# Altium schematic sheet 4-USB & SATA.SchDoc: USB & SATA
size B; CompanyName: NGRF; Address1: 2130 Howard Drive W; Address2: North Mankato, MN 56003; Address3: www.nextgenrf.com; Revision: 2; SheetNumber: 4; SheetTotal: 7; ProjName: BytePipe X9002_HDK
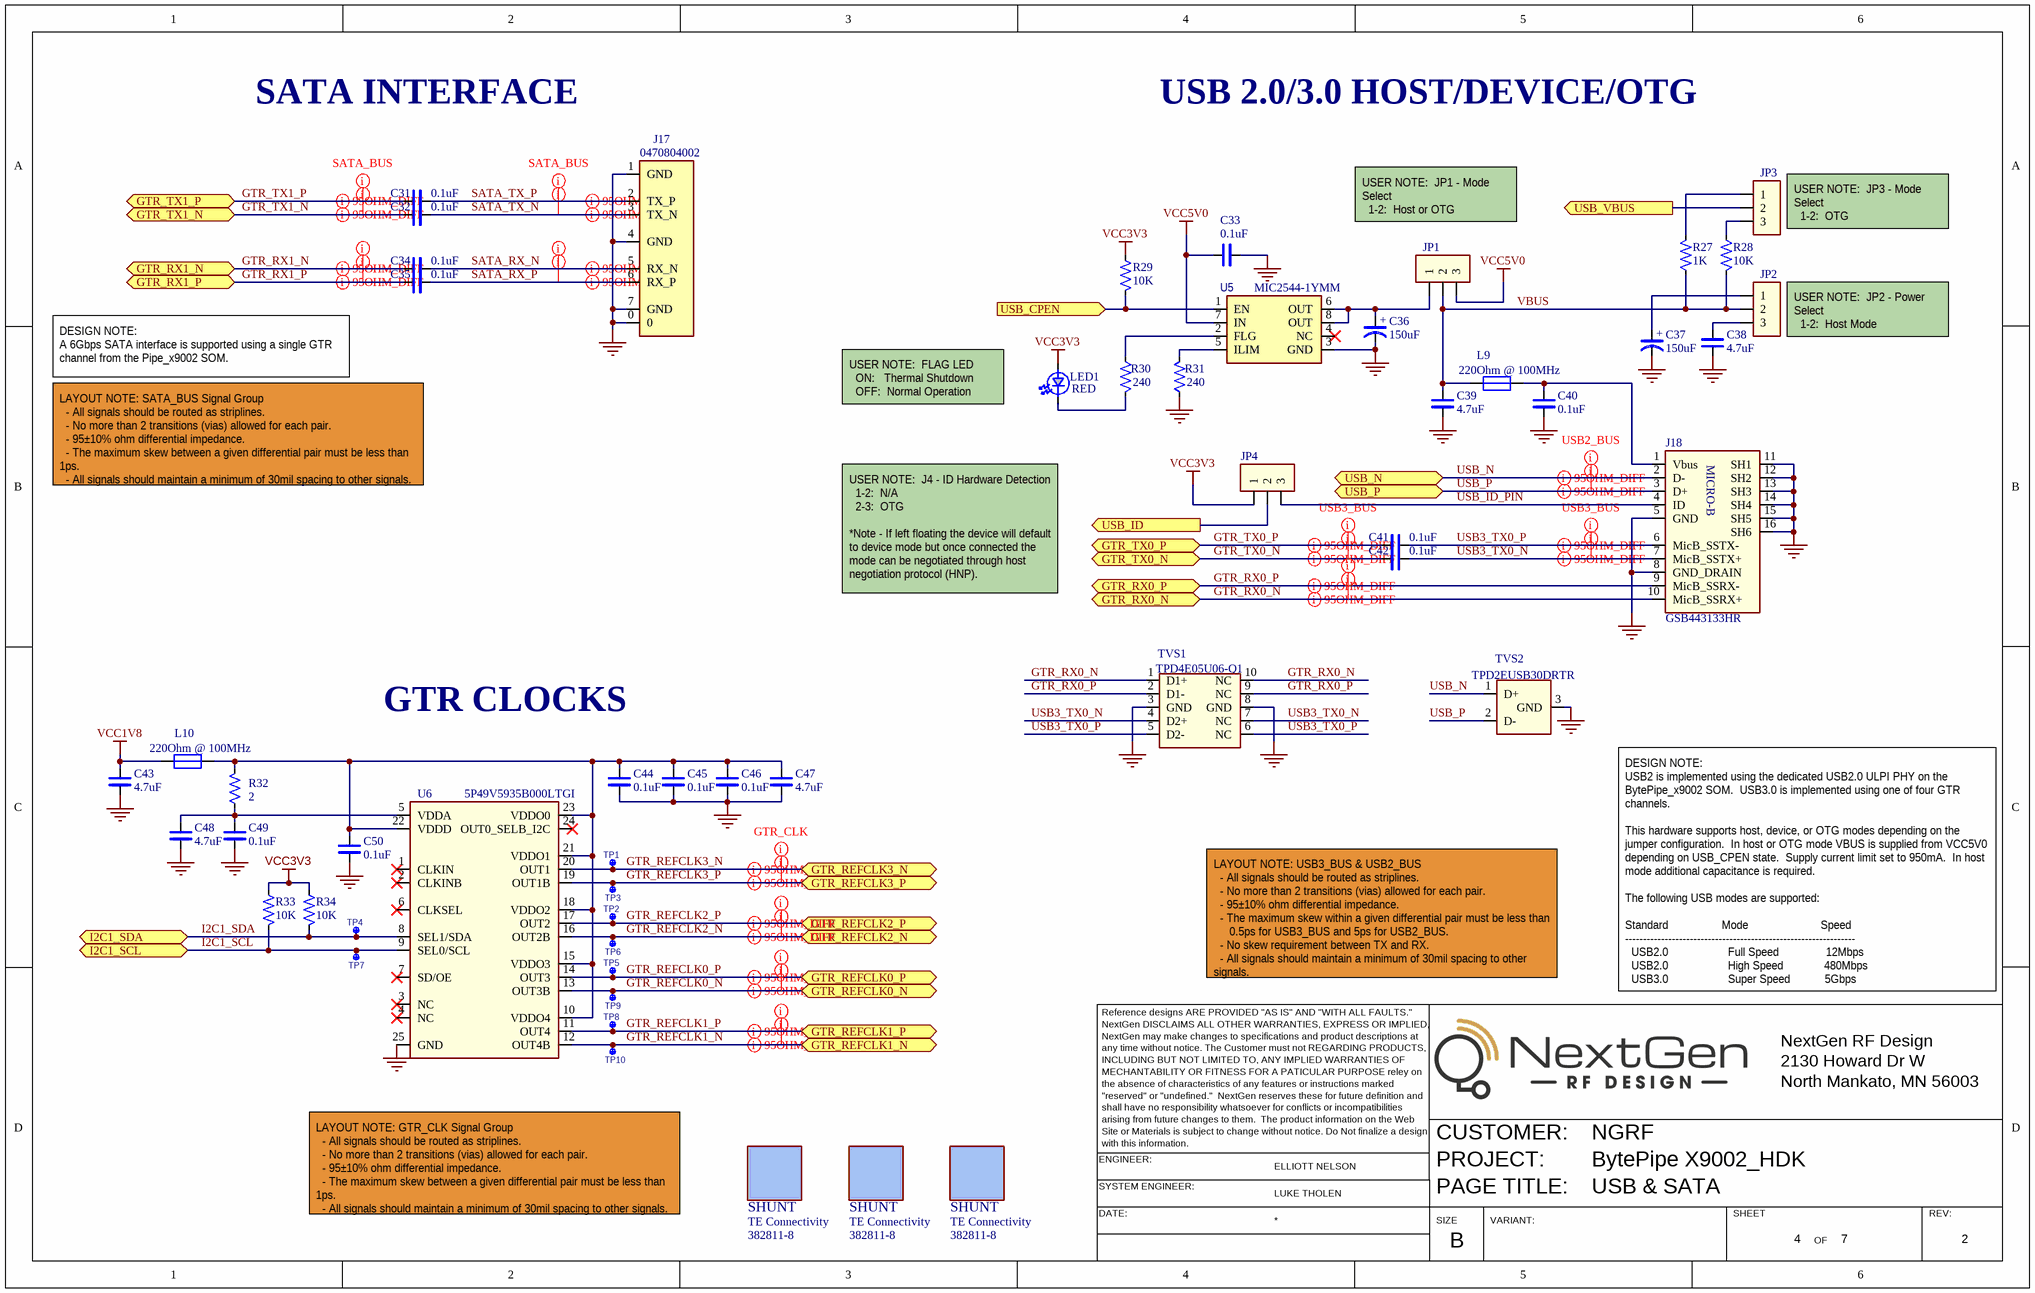
[diagram p0: 4-USB & SATA.SchDoc]

## Parts
C31  value 0.1uF  [SM/0402/CAP]  (hidden comment: CAP_CERAMIC_0402)
C32  value 0.1uF  [SM/0402/CAP]  (hidden comment: CAP_CERAMIC_0402)
C33  value 0.1uF  [SM/0402/CAP]  (hidden comment: CAP_CERAMIC_0402)
C34  value 0.1uF  [SM/0402/CAP]  (hidden comment: CAP_CERAMIC_0402)
C35  value 0.1uF  [SM/0402/CAP]  (hidden comment: CAP_CERAMIC_0402)
C36  value 150uF  [SM/CAP/TANT-D_A]  (hidden comment: TANT-D)
C37  value 150uF  [SM/CAP/TANT-D_A]  (hidden comment: TANT-D)
C38  value 4.7uF  [SM/0402/CAP]  (hidden comment: CAP_CERAMIC_0402)
C39  value 4.7uF  [SM/0402/CAP]  (hidden comment: CAP_CERAMIC_0402)
C40  value 0.1uF  [SM/0402/CAP]  (hidden comment: CAP_CERAMIC_0402)
C41  value 0.1uF  [SM/0402/CAP]  (hidden comment: CAP_CERAMIC_0402)
C42  value 0.1uF  [SM/0402/CAP]  (hidden comment: CAP_CERAMIC_0402)
C43  value 4.7uF  [SM/0402/CAP]  (hidden comment: CAP_CERAMIC_0402)
C44  value 0.1uF  [SM/0402/CAP]  (hidden comment: CAP_CERAMIC_0402)
C45  value 0.1uF  [SM/0402/CAP]  (hidden comment: CAP_CERAMIC_0402)
C46  value 0.1uF  [SM/0402/CAP]  (hidden comment: CAP_CERAMIC_0402)
C47  value 4.7uF  [SM/0402/CAP]  (hidden comment: CAP_CERAMIC_0402)
C48  value 4.7uF  [SM/0402/CAP]  (hidden comment: CAP_CERAMIC_0402)
C49  value 0.1uF  [SM/0402/CAP]  (hidden comment: CAP_CERAMIC_0402)
C50  value 0.1uF  [SM/0402/CAP]  (hidden comment: CAP_CERAMIC_0402)
J17  value 0470804002  [SM/CON/MLX/SATA/0470804002]  (hidden comment: CON_MOLEX_0470804002)
J18  value GSB443133HR  [SM/CON/USB3.1/MICRO B]  (hidden comment: CON_USB_3.1_MICRO-B_RA)
JP1  CON_100SP_1X3P_038H  [CON/100SP/1X3P]  (value not drawn)
JP2  CON_100SP_1X3P_038H  [CON/100SP/1X3P]  (value not drawn)
JP3  CON_100SP_1X3P_038H  [CON/100SP/1X3P]  (value not drawn)
JP4  CON_100SP_1X3P_038H  [CON/100SP/1X3P]  (value not drawn)
L9  value 220Ohm @ 100MHz  [SM/0603]  (hidden comment: FERRITE_0603_A)
L10  value 220Ohm @ 100MHz  [SM/0603]  (hidden comment: FERRITE_0603_A)
LED1  value RED  [SM/LED_0603]  (hidden comment: LED_0603)
R27  value 1K  [SM/0402/RES]  (hidden comment: RES_0402_A)
R28  value 10K  [SM/0402/RES]  (hidden comment: RES_0402_A)
R29  value 10K  [SM/0402/RES]  (hidden comment: RES_0402_A)
R30  value 240  [SM/0402/RES]  (hidden comment: RES_0402_A)
R31  value 240  [SM/0402/RES]  (hidden comment: RES_0402_A)
R32  value 2  [SM/0402/RES]  (hidden comment: RES_0402_A)
R33  value 10K  [SM/0402/RES]  (hidden comment: RES_0402_A)
R34  value 10K  [SM/0402/RES]  (hidden comment: RES_0402_A)
S1  SHUNT  OEM NAME: TE Connectivity  OEM#: 382811-8
S2  SHUNT  OEM NAME: TE Connectivity  OEM#: 382811-8
S3  SHUNT  OEM NAME: TE Connectivity  OEM#: 382811-8
TP1  TESTPOINT_030  [SM/TESTPOINT/30MIL]  (value not drawn)  (no BOM)
TP2  TESTPOINT_030  [SM/TESTPOINT/30MIL]  (value not drawn)  (no BOM)
TP3  TESTPOINT_030  [SM/TESTPOINT/30MIL]  (value not drawn)  (no BOM)
TP4  TESTPOINT_030  [SM/TESTPOINT/30MIL]  (value not drawn)  (no BOM)
TP5  TESTPOINT_030  [SM/TESTPOINT/30MIL]  (value not drawn)  (no BOM)
TP6  TESTPOINT_030  [SM/TESTPOINT/30MIL]  (value not drawn)  (no BOM)
TP7  TESTPOINT_030  [SM/TESTPOINT/30MIL]  (value not drawn)  (no BOM)
TP8  TESTPOINT_030  [SM/TESTPOINT/30MIL]  (value not drawn)  (no BOM)
TP9  TESTPOINT_030  [SM/TESTPOINT/30MIL]  (value not drawn)  (no BOM)
TP10  TESTPOINT_030  [SM/TESTPOINT/30MIL]  (value not drawn)  (no BOM)
TVS1  value TPD4E05U06-Q1  [SM/DFN10/2.5X1MM_A]  (hidden comment: TVS_TPD4E05U06_2.5mmX1mm)
TVS2  value TPD2EUSB30DRTR  [SM/SOT3_A]  (hidden comment: TVS_TPD2EUSB30DRTR_SOT3)
U5  value MIC2544-1YMM  [SM/MSOP8_A]  (hidden comment: IC_MIC2544-1YMM_MSOP-8)
U6  value 5P49V5935B000LTGI  [SM/LGA24/4X4/0.5LS_A]  (hidden comment: IC_5P49V5935_LGA-24)

## Ports
GTR_REFCLK0_N (bidir), GTR_REFCLK0_P (bidir), GTR_REFCLK1_N (bidir), GTR_REFCLK1_P (bidir), GTR_REFCLK2_N (bidir), GTR_REFCLK2_P (bidir), GTR_REFCLK3_N (bidir), GTR_REFCLK3_P (bidir), GTR_RX0_N (bidir), GTR_RX0_P (bidir), GTR_RX1_N (bidir), GTR_RX1_P (bidir), GTR_TX0_N (bidir), GTR_TX0_P (bidir), GTR_TX1_N (bidir), GTR_TX1_P (bidir), I2C1_SCL (bidir), I2C1_SDA (bidir), USB_CPEN (in), USB_ID (out), USB_N (bidir), USB_P (bidir), USB_VBUS (out)

## Nets
GND: C33.2(N2) C36.2(N) C37.2(N) C38.2(N2) C39.2(N2) C40.2(N2) C43.2(N2) C44.2(N2) C45.2(N2) C46.2(N2) C47.2(N2) C48.2(N2) C49.2(N2) C50.2(N2) J17.0 J17.1(GND) J17.4(GND) J17.7(GND) J18.5(GND) J18.8(GND_DRAIN) J18.11(SH1) J18.12(SH2) J18.13(SH3) J18.14(SH4) J18.15(SH5) J18.16(SH6) R31.2 TVS1.3(GND) TVS1.8(GND) TVS2.3(GND) U5.3(GND) U6.25(GND)
VCC1V8: C43.1(N1) L10.1(PIN1)
VCC3V3: JP4.1 LED1.2(A) R29.1 R33.1 R34.1
VCC5V0: C33.1(N1) JP1.3 U5.7(IN)
GTR_REFCLK0_N: TP9.1(N1) U6.13(OUT3B) ; port GTR_REFCLK0_N
GTR_REFCLK0_P: TP5.1(N1) U6.14(OUT3) ; port GTR_REFCLK0_P
GTR_REFCLK1_N: TP10.1(N1) U6.12(OUT4B) ; port GTR_REFCLK1_N
GTR_REFCLK1_P: TP8.1(N1) U6.11(OUT4) ; port GTR_REFCLK1_P
GTR_REFCLK2_N: TP6.1(N1) U6.16(OUT2B) ; port GTR_REFCLK2_N
GTR_REFCLK2_P: TP2.1(N1) U6.17(OUT2) ; port GTR_REFCLK2_P
GTR_REFCLK3_N: TP1.1(N1) U6.20(OUT1) ; port GTR_REFCLK3_N
GTR_REFCLK3_P: TP3.1(N1) U6.19(OUT1B) ; port GTR_REFCLK3_P
GTR_RX0_N: J18.10(MicB_SSRX+) TVS1.1(D1+) TVS1.10(NC) ; port GTR_RX0_N
GTR_RX0_P: J18.9(MicB_SSRX-) TVS1.2(D1-) TVS1.9(NC) ; port GTR_RX0_P
GTR_RX1_N: C34.1(N1) ; port GTR_RX1_N
GTR_RX1_P: C35.1(N1) ; port GTR_RX1_P
GTR_TX0_N: C42.1(N1) ; port GTR_TX0_N
GTR_TX0_P: C41.1(N1) ; port GTR_TX0_P
GTR_TX1_N: C32.1(N1) ; port GTR_TX1_N
GTR_TX1_P: C31.1(N1) ; port GTR_TX1_P
I2C1_SCL: R33.2 TP7.1(N1) U6.9(SEL0/SCL) ; port I2C1_SCL
I2C1_SDA: R34.2 TP4.1(N1) U6.8(SEL1/SDA) ; port I2C1_SDA
SATA_RX_N: C34.2(N2) J17.5(RX_N)
SATA_RX_P: C35.2(N2) J17.6(RX_P)
SATA_TX_N: C32.2(N2) J17.3(TX_N)
SATA_TX_P: C31.2(N2) J17.2(TX_P)
USB3_TX0_N: C42.2(N2) J18.7(MicB_SSTX+) TVS1.4(D2+) TVS1.7(NC)
USB3_TX0_P: C41.2(N2) J18.6(MicB_SSTX-) TVS1.5(D2-) TVS1.6(NC)
USB_CPEN: R29.2 U5.1(EN) ; port USB_CPEN
USB_ID: JP4.2 ; port USB_ID
USB_ID_PIN: J18.4(ID) JP4.3
USB_N: J18.2(D-) TVS2.1(D+) ; port USB_N
USB_P: J18.3(D+) TVS2.2(D-) ; port USB_P
USB_VBUS: JP3.2 ; port USB_VBUS
VBUS: C39.1(N1) JP1.2 JP2.2 L9.1(PIN1) R27.1 R28.2
NetC36_1: C36.1(+) JP1.1 U5.6(OUT) U5.8(OUT)
NetC37_1: C37.1(+) JP2.1
NetC38_1: C38.1(N1) JP2.3
NetC40_1: C40.1(N1) J18.1(Vbus) L9.2(PIN2)
NetC44_1: C44.1(N1) C45.1(N1) C46.1(N1) C47.1(N1) C50.1(N1) L10.2(PIN2) R32.1 U6.10(VDDO4) U6.15(VDDO3) U6.18(VDDO2) U6.21(VDDO1) U6.22(VDDD) U6.23(VDDO0)
NetC48_1: C48.1(N1) C49.1(N1) R32.2 U6.5(VDDA)
NetJP3_1: JP3.1 R27.2
NetJP3_3: JP3.3 R28.1
NetLED1_1: LED1.1(C) R30.1
NetR30_2: R30.2 U5.2(FLG)
NetR31_1: R31.1 U5.5(ILIM)

Not connected (* = marked no-connect by the designer): U5 4(NC)*; U6 1(CLKIN)* 2(CLKINB)* 3(NC)* 4(NC)* 6(CLKSEL)* 7(SD/OE)* 24(OUT0_SELB_I2C)*

## Layout directives
net class USB3_BUS: GTR_RX0_N, GTR_RX0_P, GTR_TX0_N, GTR_TX0_P, USB3_TX0_N, USB3_TX0_P
net class USB2_BUS: USB_N, USB_P
differential pair; Impedance: 90 Ohms; differential pair class 95OHM_DIFF: GTR_REFCLK0_N, GTR_REFCLK0_P, GTR_REFCLK1_N, GTR_REFCLK1_P, GTR_REFCLK2_N, GTR_REFCLK2_P, GTR_REFCLK3_N, GTR_REFCLK3_P, GTR_RX0_N, GTR_RX0_P, GTR_RX1_N, GTR_RX1_P, GTR_TX0_N, GTR_TX0_P, GTR_TX1_N, GTR_TX1_P, SATA_RX_N, SATA_RX_P, SATA_TX_N, SATA_TX_P, USB3_TX0_N, USB3_TX0_P, USB_N, USB_P
net class SATA_BUS: GTR_RX1_N, GTR_RX1_P, GTR_TX1_N, GTR_TX1_P, SATA_RX_N, SATA_RX_P, SATA_TX_N, SATA_TX_P
net class GTR_CLK: GTR_REFCLK0_N, GTR_REFCLK0_P, GTR_REFCLK1_N, GTR_REFCLK1_P, GTR_REFCLK2_N, GTR_REFCLK2_P, GTR_REFCLK3_N, GTR_REFCLK3_P

## Notes on the sheet
- SATA INTERFACE
- USB 2.0/3.0 HOST/DEVICE/OTG
- USER NOTE:  JP1 - Mode Select
  1-2:  Host or OTG
  2-3:  Device
- (near JP3) USER NOTE:  JP3 - Mode Select
  1-2:  OTG
  2-3:  Device or Host
- DESIGN NOTE:
  A 6Gbps SATA interface is supported using a single GTR channel from the Pipe_x9002 SOM.
- (near JP2) USER NOTE:  JP2 - Power Select
  1-2:  Host Mode
  2-3:  Device or OTG
- USER NOTE:  FLAG LED
  ON:   Thermal Shutdown
  OFF:  Normal Operation
- LAYOUT NOTE: SATA_BUS Signal Group
  - All signals should be routed as striplines.
  - No more than 2 transitions (vias) allowed for each pair.
  - 95±10% ohm differential impedance.
  - The maximum skew between a given differential pair must be less than 1ps.
  - All signals should maintain a minimum of 30mil spacing to other signals.
- USER NOTE:  J4 - ID Hardware Detection
  1-2:  N/A
  2-3:  OTG
  *Note - If left floating the device will default to device mode but once connected the mode can be negotiated through host negotiation protocol (HNP).
- GTR CLOCKS
- LAYOUT NOTE: USB3_BUS & USB2_BUS
  - All signals should be routed as striplines.
  - No more than 2 transitions (vias) allowed for each pair.
  - 95±10% ohm differential impedance.
  - The maximum skew within a given differential pair must be less than
  0.5ps for USB3_BUS and 5ps for USB2_BUS.
  - No skew requirement between TX and RX.
  - All signals should maintain a minimum of 30mil spacing to other signals.
- Reference designs ARE PROVIDED "AS IS" AND "WITH ALL FAULTS."
- NextGen DISCLAIMS ALL OTHER WARRANTIES, EXPRESS OR IMPLIED,
- NextGen may make changes to specifications and product descriptions at
- DESIGN NOTE:
  USB2 is implemented using the dedicated USB2.0 ULPI PHY on the BytePipe_x9002 SOM.  USB3.0 is implemented using one of four GTR channels.
  This hardware supports host, device, or OTG modes depending on the jumper configuration.  In host or OTG mode VBUS is supplied from VCC5V0 depending on USB_CPEN state.  Supply current limit set to 950mA.  In host mode additional capacitance is required.
  The following USB modes are supported:
  Standard                 Mode                       Speed
  ----------------------------------------------------------------
  USB2.0                   Full Speed               12Mbps
  USB2.0                   High Speed             480Mbps
  USB3.0                   Super Speed           5Gbps
- NextGen RF Design
- any time without notice. The Customer must not REGARDING PRODUCTS,
- INCLUDING BUT NOT LIMITED TO, ANY IMPLIED WARRANTIES OF
- MECHANTABILITY OR FITNESS FOR A PATICULAR PURPOSE reley on
- "reserved" or "undefined."  NextGen reserves these for future definition and
- the absence of characteristics of any features or instructions marked
- shall have no responsibility whatsoever for conflicts or incompatibilities
- 2130 Howard Dr W
- North Mankato, MN 56003
- ENGINEER:
- Site or Materials is subject to change without notice. Do Not finalize a design
- with this information.
- arising from future changes to them.  The product information on the Web
- ELLIOTT NELSON
- CUSTOMER:
- PROJECT:
- LAYOUT NOTE: GTR_CLK Signal Group
  - All signals should be routed as striplines.
  - No more than 2 transitions (vias) allowed for each pair.
  - 95±10% ohm differential impedance.
  - The maximum skew between a given differential pair must be less than 1ps.
  - All signals should maintain a minimum of 30mil spacing to other signals.
- SYSTEM ENGINEER:
- DATE:
- LUKE THOLEN
- SIZE
- PAGE TITLE:
- VARIANT:
- SHEET
- OF
- REV:
- B
- (in symbol CON_USB_3.1_MICRO-B_RA) MICRO-B

## Library data of the parts
C31-C35 C40-C42 C44-C46 C49 C50 = CAP_CERAMIC_0402: CAP CER 0.1UF 25V X7R 0402; TOL: ±10%; OEM#: CL05B104KA5NNNC; OEM NAME: Samsung; VOLT: 25V
C36 C37 = CAP_TANT-D: CAP TANT 150UF 20% 10V 2917; OEM#: T491D157M010AT; OEM NAME: KEMET; VOLTS: 10V
C38 C39 C43 C47 C48 = CAP_CERAMIC_0402: CAP CER 4.7UF 10V X5R 0402; TOL: ±20%; OEM#: CL05A475MP5NRNC; OEM NAME: Samsung; VOLT: 10V
J17 = CON_MOLEX_0470804002: 7 Position SATA Plug Connector Solder Surface Mount, Right Angle; OEM NAME: MOLEX; OEM#: 0470804002
J18 = CON_USB_3.1_MICRO-B_RA: CONN RCPT USB3.1 MICRO B SMD R/A; OEM NAME: Amphenol ICC; OEM#: GSB443133HR
JP1-JP4 = CON_100SP_1X3P_038H: PIN HEADER, SINGLE ROW 3 PIN STR; OEM#: PH1-03-UA; OEM NAME: Adam Tech; VALUE: PH1-03-UA
L9 L10 = FERRITE_0603_A: 120 Ohms @ 100MHz 1 Power Line Ferrite Bead 0603 (1608 Metric) 3A 25mOhm; OEM#: BLM18SG121TN1D; OEM NAME: Murata Electronics
LED1 = LED_0603: LED-0603; OEM#: LS Q976-NR-1; OEM NAME: OSRAM
R27 = RES_0402_A: RES SMD 1K OHM 1% 1/10W 0402; OEM#: ERJ-2RKF1001X; OEM NAME: Panasonic; TOL: ±1%
R28 R29 R33 R34 = RES_0402_A: OEM#: ERJ-2RKF1002X; OEM NAME: Panasonic; TOL: ±1%
R30 R31 = RES_0402_A: RES SMD 240 OHM 1% 1/10W 0402; OEM#: ERJ-2RKF2400X; OEM NAME: Panasonic; TOL: 1%
R32 = RES_0402_A: RES 2 OHM 1% 1/10W 0402 SMD; OEM#: ERJ-U02F2R00X; OEM NAME: Panasonic; TOL: ±1%
S1-S3 = BOM_COMPONENT_NO-FOOTPRINT: VALUE: SHUNT
TVS1 = TVS_TPD4E05U06_2.5mmX1mm: TVS DIODE 5.5V 14V 10SON; OEM NAME: TI; OEM#: TPD4E05U06-Q1
TVS2 = TVS_TPD2EUSB30DRTR_SOT3: TVS DIODE 5.5V 8V SOT3; OEM NAME: Texas Instruments; WATT: 45; OEM#: TPD2EUSB30DRTR
U5 = IC_MIC2544-1YMM_MSOP-8: Power Switch/Driver 1:1 N-Channel 1.5A 8-MSOP; OEM NAME: MICROCHIP; OEM#: MIC2544-1YMM
U6 = IC_5P49V5935_LGA-24: IC Programable Clock Generator; OEM NAME: Renesas; OEM#: 5P49V5935B000LTGI